# Altium project bms_fan_breakout-1_0.PrjPcb
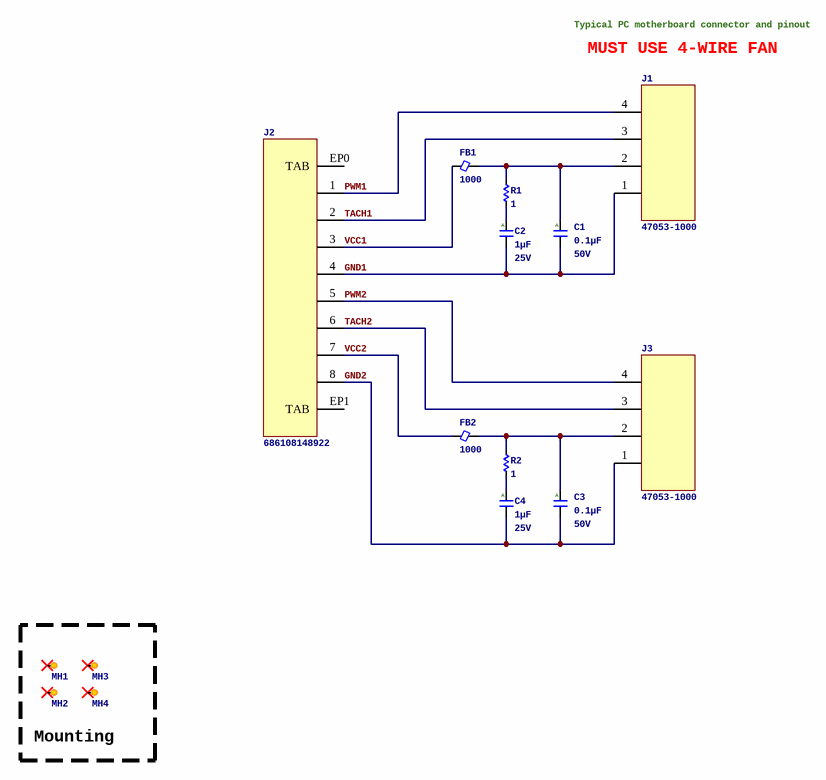
[diagram p0: top.SchDoc]
1 sheet, 15 parts. Net scope: strictly hierarchical (ports join the sheet entries above them; power ports are local).
Board file: bms_fan_breakout-1_0.PcbDoc

## Sheet top.SchDoc
size A; SheetNumber: 1

### Parts
C1  Capacitance: 0.1µF  Voltage - Rated: 50V  [C0402_0.55MM]  (hidden comment: CGA2B3X7R1H104M050BB)
C2  Capacitance: 1µF  Voltage - Rated: 25V  [C0603_0.80MM]  (hidden comment: CGJ3E1X7R1E105K080AC)
C3  Capacitance: 0.1µF  Voltage - Rated: 50V  [C0402_0.55MM]  (hidden comment: CGA2B3X7R1H104M050BB)
C4  Capacitance: 1µF  Voltage - Rated: 25V  [C0603_0.80MM]  (hidden comment: CGJ3E1X7R1E105K080AC)
FB1  Impedance (Ohms @ 100MHz): 1000  [FB0805_1.05MM]  (hidden comment: MPZ2012S102AT000)
FB2  Impedance (Ohms @ 100MHz): 1000  [FB0805_1.05MM]  (hidden comment: MPZ2012S102AT000)
J1  47053-1000  [MOLEX_KK254_4POS_VERT_0470531000]
J2  686108148922  [WURTH_WR-FPC_1.00mm_686108148922]
J3  47053-1000  [MOLEX_KK254_4POS_VERT_0470531000]
MH1  HOLE  [HOLE_M3]  (value not drawn)  (no BOM)
MH2  HOLE  [HOLE_M3]  (value not drawn)  (no BOM)
MH3  HOLE  [HOLE_M3]  (value not drawn)  (no BOM)
MH4  HOLE  [HOLE_M3]  (value not drawn)  (no BOM)
R1  Resistance: 1  [R0402_0.40MM]  (hidden comment: ERJ-2BQF1R0X)
R2  Resistance: 1  [R0402_0.40MM]  (hidden comment: ERJ-2BQF1R0X)

### Blocks framed on the sheet
Mounting: MH1-MH4

### Nets
GND1: C1.2 C2.2 J1.1 J2.4
GND2: C3.2 C4.2 J2.8 J3.1
PWM1: J1.4 J2.1
PWM2: J2.5 J3.4
TACH1: J1.3 J2.2
TACH2: J2.6 J3.3
VCC1: FB1.1 J2.3
VCC2: FB2.1 J2.7
NetC1_1: C1.1 FB1.2 J1.2 R1.2
NetC2_1: C2.1 R1.1
NetC3_1: C3.1 FB2.2 J3.2 R2.2
NetC4_1: C4.1 R2.1

Not connected (* = marked no-connect by the designer): J2 EP0(TAB) EP1(TAB); MH1 1*; MH2 1*; MH3 1*; MH4 1*

### Notes on the sheet
- Typical PC motherboard connector and pinout
- MUST USE 4-WIRE FAN
- (in symbol CGA2B3X7R1H104M050BB) A
- (in symbol CGJ3E1X7R1E105K080AC) A

### Library data of the parts
C1 C3 = CGA2B3X7R1H104M050BB: CAP CER 0.1UF 50V X7R 0402; Manufacturer: TDK Corporation; Unit Price (USD): 0.17; Tolerance: ±20%; ComponentLink1URL: https://product.tdk.com/info/en/catalog/datasheets/mlcc_automotive_general_en.pdf?ref_disty=digikey; ComponentLink1Description: Series Datasheet; Series: CGA; Part Status: Active; Temperature Coefficient: X7R; Operating Temperature: -55°C ~ 125°C; Applications: AEC-Q200; Mounting Type: Surface Mount, MLCC; Package / Case: 0402 (1005 Metric); Size / Dimension: 0.039" L x 0.020" W (1.00mm x 0.50mm); Thickness (Max): 0.022" (0.55mm); Supplier 1: Digikey; Supplier Part Number 1: 445-12271-1-ND; Manufacturer Part Number: CGA2B3X7R1H104M050BB
C2 C4 = CGJ3E1X7R1E105K080AC: CAP CER 1UF 25V X7R 0603; Manufacturer: TDK Corporation; Unit Price (USD): 0.55; Tolerance: ±10%; ComponentLink1URL: https://product.tdk.com/info/en/catalog/datasheets/mlcc_highreliability_general_en.pdf?ref_disty=digikey; ComponentLink1Description: Series Datasheet; Series: CGJ; Part Status: Active; Temperature Coefficient: X7R; Operating Temperature: -55°C ~ 125°C; Applications: AEC-Q200; Mounting Type: Surface Mount, MLCC; Package / Case: 0603 (1608 Metric); Size / Dimension: 0.063" L x 0.031" W (1.60mm x 0.80mm); Thickness (Max): 0.031" (0.80mm); Supplier 1: Digikey; Supplier Part Number 1: 445-13311-1-ND; Manufacturer Part Number: CGJ3E1X7R1E105K080AC
FB1 FB2 = MPZ2012S102AT000: FERRITE BEAD 1 KOHM 0805 1LN; Manufacturer: TDK Corporation; Filter Type: Power Line; Current Rating (Max): 1.5A; DC Resistance (DCR) (Max): 150mOhm; ComponentLink1URL: https://product.tdk.com/info/en/catalog/datasheets/beads_commercial_power_mpz2012_en.pdf?ref_disty=digikey; ComponentLink1Description: Datasheet; Series: MPZ; Part Status: Active; Operating Temperature: -55°C ~ 125°C; Package / Case: 0805 (2012 Metric); Mounting Type: Surface Mount; Height (Max): 0.041" (1.05mm); Size / Dimension: 0.079" L x 0.049" W (2.00mm x 1.25mm); Supplier Part Number 1: 445-5223-1-ND; Supplier 1: Digikey; Manufacturer Part Number: MPZ2012S102AT000
J1 J3 = CONN_MOLEX_KK254_4POS_VERT_47053-1000: Board Connector, 4 Contact(s), 1 Row(s), Male, Straight, 0.1 inch Pitch, Solder Terminal, Locking, White Insulator, Receptacle; Manufacturer: Molex; Supplier 1: Digikey; Supplier Part Number 1: WM4330-ND; Manufacturer Part Number: 47053-1000; ComponentLink1URL: https://www.molex.com/content/dam/molex/molex-dot-com/products/automated/en-us/salesdrawingpdf/470/47053/470531000_sd.pdf?inline; ComponentLink1Description: Drawing; ComponentLink2Description: Product page; ComponentLink2URL: https://www.molex.com/en-us/products/part-detail/470531000; Supplier 2: LCSC; Supplier Part Number 2: C240840
J2 = CONN_WURTH_WR-FPC_8POS_1.00mm_686108148922: WR-FPC 1mm SMT Horiz. Bot. Contact Hinge type; Manufacturer: Wurth Elektronik; Supplier 1: Digikey; Supplier Part Number 1: 732-6018-1-ND; Manufacturer Part Number: 686108148922; Supplier 2: Mouser; Supplier Part Number 2: 710-686108148922; ComponentLink1Description: Drawing; ComponentLink1URL: https://www.we-online.com/components/products/datasheet/686104148922.pdf
R1 R2 = ERJ-2BQF1R0X: RES SMD 1 OHM 1% 1/6W 0402; Manufacturer: Panasonic Electronic Components; Unit Price (USD): 0.41; Power (Watts): 0.167W, 1/6W; Temperature Coefficient: ±250ppm/°C; ComponentLink1Description: Datasheet; ComponentLink1URL: https://industrial.panasonic.com/cdbs/www-data/pdf/RDN0000/AOA0000C313.pdf; Series: ERJ; Tolerance: ±1%; Composition: Thick Film; Features: Automotive AEC-Q200, Current Sense; Operating Temperature: -55°C ~ 125°C; Package / Case: 0402 (1005 Metric); Supplier Device Package: 0402; Size / Dimension: 0.039" L x 0.020" W (1.00mm x 0.50mm); Height - Seated (Max): 0.016" (0.40mm); Supplier 1: Digikey; Supplier Part Number 1: P17252CT-ND; Manufacturer Part Number: ERJ-2BQF1R0X